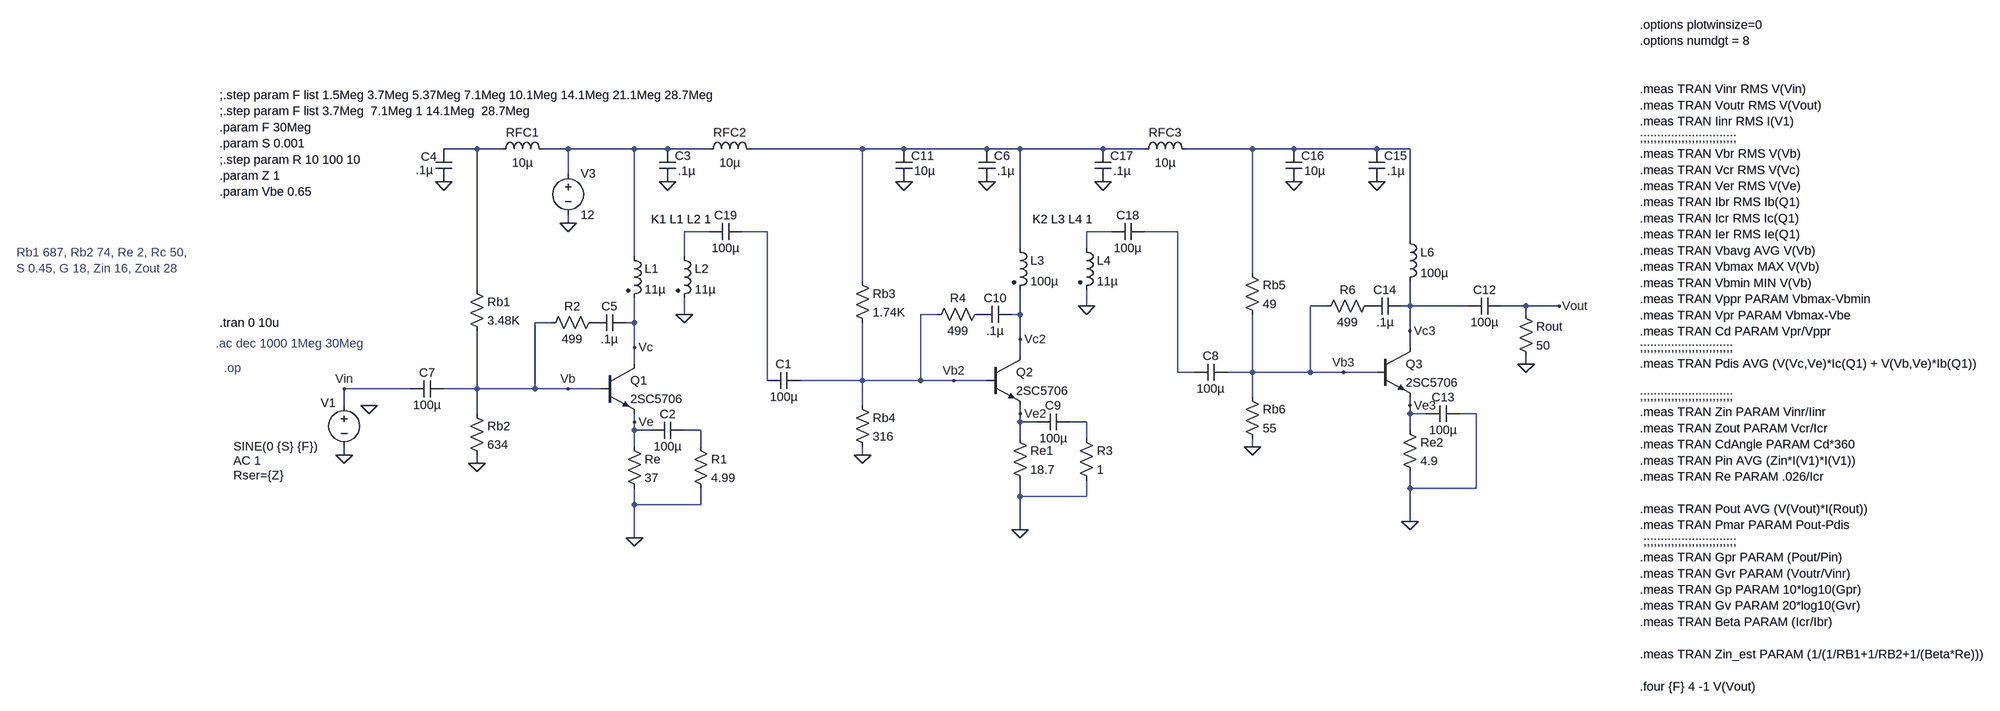
[diagram p0: schematic 2SC5706x3  testing.asc]
2SC5706x3  testing.asc, the LTspice schematic file:
Version 4
SHEET 1 3408 1496
WIRE 112 -272 48 -272
WIRE 160 -272 112 -272
WIRE 288 -272 240 -272
WIRE 416 -272 288 -272
WIRE 480 -272 416 -272
WIRE 560 -272 480 -272
WIRE 896 -272 640 -272
WIRE 976 -272 896 -272
WIRE 1136 -272 976 -272
WIRE 1200 -272 1136 -272
WIRE 1360 -272 1200 -272
WIRE 1440 -272 1360 -272
WIRE 1648 -272 1520 -272
WIRE 1728 -272 1648 -272
WIRE 1888 -272 1728 -272
WIRE 1952 -272 1888 -272
WIRE 288 -224 288 -272
WIRE 288 -128 288 -144
WIRE 560 -112 512 -112
WIRE 672 -112 624 -112
WIRE 1376 -112 1328 -112
WIRE 1504 -112 1440 -112
WIRE 1952 -96 1952 -272
WIRE 1200 -80 1200 -272
WIRE 1328 -80 1328 -112
WIRE 416 -64 416 -272
WIRE 512 -64 512 -112
WIRE 1648 -32 1648 -272
WIRE 896 -16 896 -272
WIRE 112 0 112 -272
WIRE 1328 32 1328 0
WIRE 1792 32 1760 32
WIRE 1952 32 1952 -16
WIRE 1952 32 1936 32
WIRE 2064 32 1952 32
WIRE 2176 32 2128 32
WIRE 2240 32 2176 32
WIRE 512 48 512 16
WIRE 1040 48 1008 48
WIRE 1200 48 1200 0
WIRE 1200 48 1184 48
WIRE 2176 48 2176 32
WIRE 256 64 224 64
WIRE 416 64 416 16
WIRE 416 64 400 64
WIRE 1952 80 1952 32
WIRE 1200 96 1200 48
WIRE 416 112 416 64
WIRE 1952 112 1952 80
WIRE 1200 128 1200 96
WIRE 416 144 416 112
WIRE 2176 144 2176 128
WIRE 1504 160 1504 -112
WIRE 1536 160 1504 160
WIRE 1648 160 1648 48
WIRE 1648 160 1600 160
WIRE 1760 160 1760 32
WIRE 1760 160 1648 160
WIRE 1824 160 1760 160
WIRE 1888 160 1824 160
WIRE 672 176 672 -112
WIRE 896 176 896 64
WIRE 896 176 736 176
WIRE 1008 176 1008 48
WIRE 1008 176 896 176
WIRE 1072 176 1008 176
WIRE 1136 176 1072 176
WIRE -16 192 -144 192
WIRE 112 192 112 80
WIRE 112 192 48 192
WIRE 224 192 224 64
WIRE 224 192 112 192
WIRE 288 192 224 192
WIRE 352 192 288 192
WIRE 1648 208 1648 160
WIRE -144 224 -144 192
WIRE 896 224 896 176
WIRE 1952 224 1952 208
WIRE 112 240 112 192
WIRE 1200 240 1200 224
WIRE 1952 240 1952 224
WIRE 1984 240 1952 240
WIRE 2080 240 2048 240
WIRE 416 256 416 240
WIRE 1200 256 1200 240
WIRE 1232 256 1200 256
WIRE 1328 256 1296 256
WIRE 416 272 416 256
WIRE 448 272 416 272
WIRE 544 272 512 272
WIRE 1952 272 1952 240
WIRE 1200 288 1200 256
WIRE 1328 288 1328 256
WIRE 416 304 416 272
WIRE 544 304 544 272
WIRE 1648 304 1648 288
WIRE -144 320 -144 304
WIRE 896 320 896 304
WIRE 112 336 112 320
WIRE 1952 384 1952 352
WIRE 2080 384 2080 240
WIRE 2080 384 1952 384
WIRE 1200 400 1200 368
WIRE 1328 400 1328 368
WIRE 1328 400 1200 400
WIRE 416 416 416 384
WIRE 544 416 544 384
WIRE 544 416 416 416
WIRE 1952 448 1952 384
WIRE 1200 464 1200 400
WIRE 416 480 416 416
FLAG -144 320 0
FLAG 112 336 0
FLAG 416 480 0
FLAG 2240 32 Vout
FLAG 2176 144 0
FLAG 288 192 Vb
FLAG 416 256 Ve
FLAG -144 192 Vin
FLAG 416 112 Vc
FLAG 288 -128 0
FLAG 48 -208 0
FLAG 480 -208 0
FLAG -96 224 0
FLAG 896 320 0
FLAG 1072 176 Vb2
FLAG 1200 240 Ve2
FLAG 1200 96 Vc2
FLAG 1200 464 0
FLAG 1136 -208 0
FLAG 976 -208 0
FLAG 512 48 0
FLAG 1648 304 0
FLAG 1824 160 Vb3
FLAG 1952 224 Ve3
FLAG 1952 80 Vc3
FLAG 1952 448 0
FLAG 1888 -208 0
FLAG 1728 -208 0
FLAG 1360 -208 0
FLAG 1328 32 0
SYMBOL voltage -144 208 R0
WINDOW 0 -45 11 Left 2
WINDOW 3 -214 95 Left 2
WINDOW 123 -214 123 Left 2
WINDOW 39 -214 151 Left 2
SYMATTR InstName V1
SYMATTR Value SINE(0 {S} {F})
SYMATTR Value2 AC 1
SYMATTR SpiceLine Rser={Z}
SYMBOL res 96 -16 R0
SYMATTR InstName Rb1
SYMATTR Value 3.48K
SYMBOL res 96 224 R0
SYMATTR InstName Rb2
SYMATTR Value 634
SYMBOL res 400 288 R0
SYMATTR InstName Re
SYMATTR Value 37
SYMBOL res 2160 32 R0
SYMATTR InstName Rout
SYMATTR Value 50
SYMBOL cap 48 176 R90
WINDOW 0 0 32 VBottom 2
WINDOW 3 32 32 VTop 2
SYMATTR InstName C7
SYMATTR Value 100µ
SYMBOL npn 352 144 R0
SYMATTR InstName Q1
SYMATTR Value 2SC5706
SYMBOL voltage 288 -240 R0
WINDOW 123 0 0 Left 0
WINDOW 39 0 0 Left 0
SYMATTR InstName V3
SYMATTR Value 12
SYMBOL cap 736 160 R90
WINDOW 0 0 32 VBottom 2
WINDOW 3 32 32 VTop 2
SYMATTR InstName C1
SYMATTR Value 100µ
SYMBOL cap 512 256 R90
WINDOW 0 0 32 VBottom 2
WINDOW 3 32 32 VTop 2
SYMATTR InstName C2
SYMATTR Value 100µ
SYMBOL ind 144 -256 R270
WINDOW 0 32 56 VTop 2
WINDOW 3 5 56 VBottom 2
SYMATTR InstName RFC1
SYMATTR Value 10µ
SYMBOL cap 32 -272 R0
WINDOW 0 -28 15 Left 2
WINDOW 3 -38 41 Left 2
SYMATTR InstName C4
SYMATTR Value .1µ
SYMBOL cap 464 -272 R0
WINDOW 0 30 14 Left 2
WINDOW 3 36 43 Left 2
SYMATTR InstName C3
SYMATTR Value .1µ
SYMBOL ind2 400 -80 R0
SYMATTR InstName L1
SYMATTR Value 11µ
SYMATTR Type ind
SYMBOL res 528 288 R0
SYMATTR InstName R1
SYMATTR Value 4.99
SYMBOL cap 400 48 R90
WINDOW 0 0 32 VBottom 2
WINDOW 3 32 32 VTop 2
SYMATTR InstName C5
SYMATTR Value .1µ
SYMBOL res 352 48 R90
WINDOW 0 0 56 VBottom 2
WINDOW 3 32 56 VTop 2
SYMATTR InstName R2
SYMATTR Value 499
SYMBOL res 880 -32 R0
SYMATTR InstName Rb3
SYMATTR Value 1.74K
SYMBOL res 880 208 R0
SYMATTR InstName Rb4
SYMATTR Value 316
SYMBOL res 1184 272 R0
SYMATTR InstName Re1
SYMATTR Value 18.7
SYMBOL npn 1136 128 R0
SYMATTR InstName Q2
SYMATTR Value 2SC5706
SYMBOL cap 1600 144 R90
WINDOW 0 0 32 VBottom 2
WINDOW 3 32 32 VTop 2
SYMATTR InstName C8
SYMATTR Value 100µ
SYMBOL cap 1296 240 R90
WINDOW 0 0 32 VBottom 2
WINDOW 3 32 32 VTop 2
SYMATTR InstName C9
SYMATTR Value 100µ
SYMBOL ind2 1184 -96 R0
SYMATTR InstName L3
SYMATTR Value 100µ
SYMATTR Type ind
SYMBOL res 1312 272 R0
SYMATTR InstName R3
SYMATTR Value 1
SYMBOL cap 1184 32 R90
WINDOW 0 0 32 VBottom 2
WINDOW 3 32 32 VTop 2
SYMATTR InstName C10
SYMATTR Value .1µ
SYMBOL res 1136 32 R90
WINDOW 0 0 56 VBottom 2
WINDOW 3 32 56 VTop 2
SYMATTR InstName R4
SYMATTR Value 499
SYMBOL cap 1120 -272 R0
WINDOW 0 30 14 Left 2
WINDOW 3 36 43 Left 2
SYMATTR InstName C6
SYMATTR Value .1µ
SYMBOL ind 544 -256 R270
WINDOW 0 32 56 VTop 2
WINDOW 3 5 56 VBottom 2
SYMATTR InstName RFC2
SYMATTR Value 10µ
SYMBOL cap 960 -272 R0
WINDOW 0 30 14 Left 2
WINDOW 3 36 43 Left 2
SYMATTR InstName C11
SYMATTR Value 10µ
SYMBOL ind2 496 -80 R0
SYMATTR InstName L2
SYMATTR Value 11µ
SYMATTR Type ind
SYMBOL res 1632 -48 R0
SYMATTR InstName Rb5
SYMATTR Value 49
SYMBOL res 1632 192 R0
SYMATTR InstName Rb6
SYMATTR Value 55
SYMBOL res 1936 256 R0
SYMATTR InstName Re2
SYMATTR Value 4.9
SYMBOL npn 1888 112 R0
SYMATTR InstName Q3
SYMATTR Value 2SC5706
SYMBOL cap 2128 16 R90
WINDOW 0 0 32 VBottom 2
WINDOW 3 32 32 VTop 2
SYMATTR InstName C12
SYMATTR Value 100µ
SYMBOL cap 2048 224 R90
WINDOW 0 0 32 VBottom 2
WINDOW 3 32 32 VTop 2
SYMATTR InstName C13
SYMATTR Value 100µ
SYMBOL ind 1936 -112 R0
SYMATTR InstName L6
SYMATTR Value 100µ
SYMBOL cap 1936 16 R90
WINDOW 0 0 32 VBottom 2
WINDOW 3 32 32 VTop 2
SYMATTR InstName C14
SYMATTR Value .1µ
SYMBOL res 1888 16 R90
WINDOW 0 0 56 VBottom 2
WINDOW 3 32 56 VTop 2
SYMATTR InstName R6
SYMATTR Value 499
SYMBOL cap 1872 -272 R0
WINDOW 0 30 14 Left 2
WINDOW 3 36 43 Left 2
SYMATTR InstName C15
SYMATTR Value .1µ
SYMBOL cap 1712 -272 R0
WINDOW 0 30 14 Left 2
WINDOW 3 36 43 Left 2
SYMATTR InstName C16
SYMATTR Value 10µ
SYMBOL cap 1344 -272 R0
WINDOW 0 30 14 Left 2
WINDOW 3 36 43 Left 2
SYMATTR InstName C17
SYMATTR Value .1µ
SYMBOL ind 1424 -256 R270
WINDOW 0 32 56 VTop 2
WINDOW 3 5 56 VBottom 2
SYMATTR InstName RFC3
SYMATTR Value 10µ
SYMBOL ind2 1312 -96 R0
SYMATTR InstName L4
SYMATTR Value 11µ
SYMATTR Type ind
SYMBOL cap 1440 -128 R90
WINDOW 0 0 32 VBottom 2
WINDOW 3 32 32 VTop 2
SYMATTR InstName C18
SYMATTR Value 100µ
SYMBOL cap 624 -128 R90
WINDOW 0 0 32 VBottom 2
WINDOW 3 32 32 VTop 2
SYMATTR InstName C19
SYMATTR Value 100µ
TEXT -384 64 Left 2 !.tran 0 10u
TEXT 2672 -512 Left 2 !.options plotwinsize=0\n.options numdgt = 8\n \n \n.meas TRAN Vinr RMS V(Vin)\n.meas TRAN Voutr RMS V(Vout)\n.meas TRAN Iinr RMS I(V1)\n;;;;;;;;;;;;;;;;;;;;;;;;;;;;\n.meas TRAN Vbr RMS V(Vb)\n.meas TRAN Vcr RMS V(Vc)\n.meas TRAN Ver RMS V(Ve)\n.meas TRAN Ibr RMS Ib(Q1)\n.meas TRAN Icr RMS Ic(Q1)\n.meas TRAN Ier RMS Ie(Q1)\n.meas TRAN Vbavg AVG V(Vb)\n.meas TRAN Vbmax MAX V(Vb)\n.meas TRAN Vbmin MIN V(Vb)\n.meas TRAN Vppr PARAM Vbmax-Vbmin\n.meas TRAN Vpr PARAM Vbmax-Vbe\n.meas TRAN Cd PARAM Vpr/Vppr\n;;;;;;;;;;;;;;;;;;;;;;;;;;;\n.meas TRAN Pdis AVG (V(Vc,Ve)*Ic(Q1) + V(Vb,Ve)*Ib(Q1))\n \n;;;;;;;;;;;;;;;;;;;;;;;;;;;\n.meas TRAN Zin PARAM Vinr/Iinr\n.meas TRAN Zout PARAM Vcr/Icr\n.meas TRAN CdAngle PARAM Cd*360\n.meas TRAN Pin AVG (Zin*I(V1)*I(V1))\n.meas TRAN Re PARAM .026/Icr\n \n.meas TRAN Pout AVG (V(Vout)*I(Rout))\n.meas TRAN Pmar PARAM Pout-Pdis\n ;;;;;;;;;;;;;;;;;;;;;;;;;;;\n.meas TRAN Gpr PARAM (Pout/Pin)\n.meas TRAN Gvr PARAM (Voutr/Vinr)\n.meas TRAN Gp PARAM 10*log10(Gpr)\n.meas TRAN Gv PARAM 20*log10(Gvr)\n.meas TRAN Beta PARAM (Icr/Ibr)\n \n.meas TRAN Zin_est PARAM (1/(1/RB1+1/RB2+1/(Beta*Re)))\n \n.four {F} 4 -1 V(Vout)
TEXT -384 -376 Left 2 !;.step param F list 1.5Meg 3.7Meg 5.37Meg 7.1Meg 10.1Meg 14.1Meg 21.1Meg 28.7Meg\n;.step param F list 3.7Meg  7.1Meg 1 14.1Meg  28.7Meg\n.param F 30Meg\n.param S 0.001\n;.step param R 10 100 10\n.param Z 1\n.param Vbe 0.65
TEXT -392 104 Left 2 ;.ac dec 1000 1Meg 30Meg
TEXT -776 -72 Left 2 ;Rb1 687, Rb2 74, Re 2, Rc 50, \nS 0.45, G 18, Zin 16, Zout 28
TEXT -376 152 Left 2 ;.op
TEXT 448 -136 Left 2 !K1 L1 L2 1
TEXT 1224 -136 Left 2 !K2 L3 L4 1

The netlist it stands for:
* 2SC5706x3  testing.asc
V1 Vin 0 SINE(0 {S} {F}) AC 1 Rser={Z}
Rb1 N001 Vb 3.48K
Rb2 Vb 0 634
Re Ve 0 37
Rout Vout 0 50
C7 Vb Vin 100µ
Q1 Vc Vb Ve 0 2SC5706
V3 N002 0 12
C1 Vb2 N006 100µ
C2 N010 Ve 100µ
L§RFC1 N001 N002 10µ
C4 N001 0 .1µ
C3 N002 0 .1µ
L1 N002 Vc 11µ
R1 N010 0 4.99
C5 Vc P001 .1µ
R2 P001 Vb 499
Rb3 N003 Vb2 1.74K
Rb4 Vb2 0 316
Re1 Ve2 0 18.7
Q2 Vc2 Vb2 Ve2 0 2SC5706
C8 Vb3 N008 100µ
C9 N009 Ve2 100µ
L3 N003 Vc2 100µ
R3 N009 0 1
C10 Vc2 P002 .1µ
R4 P002 Vb2 499
C6 N003 0 .1µ
L§RFC2 N002 N003 10µ
C11 N003 0 10µ
L2 N005 0 11µ
Rb5 N004 Vb3 49
Rb6 Vb3 0 55
Re2 Ve3 0 4.9
Q3 Vc3 Vb3 Ve3 0 2SC5706
C12 Vout Vc3 100µ
C13 0 Ve3 100µ
L6 N004 Vc3 100µ
C14 Vc3 P003 .1µ
R6 P003 Vb3 499
C15 N004 0 .1µ
C16 N004 0 10µ
C17 N003 0 .1µ
L§RFC3 N003 N004 10µ
L4 N007 0 11µ
C18 N008 N007 100µ
C19 N006 N005 100µ
.model NPN NPN
.model PNP PNP
.lib standard.bjt
.tran 0 10u
.options plotwinsize=0
.options numdgt = 8
.meas TRAN Vinr RMS V(Vin)
.meas TRAN Voutr RMS V(Vout)
.meas TRAN Iinr RMS I(V1)
;;;;;;;;;;;;;;;;;;;;;;;;;;;;
.meas TRAN Vbr RMS V(Vb)
.meas TRAN Vcr RMS V(Vc)
.meas TRAN Ver RMS V(Ve)
.meas TRAN Ibr RMS Ib(Q1)
.meas TRAN Icr RMS Ic(Q1)
.meas TRAN Ier RMS Ie(Q1)
.meas TRAN Vbavg AVG V(Vb)
.meas TRAN Vbmax MAX V(Vb)
.meas TRAN Vbmin MIN V(Vb)
.meas TRAN Vppr PARAM Vbmax-Vbmin
.meas TRAN Vpr PARAM Vbmax-Vbe
.meas TRAN Cd PARAM Vpr/Vppr
;;;;;;;;;;;;;;;;;;;;;;;;;;;
.meas TRAN Pdis AVG (V(Vc,Ve)*Ic(Q1) + V(Vb,Ve)*Ib(Q1))
;;;;;;;;;;;;;;;;;;;;;;;;;;;
.meas TRAN Zin PARAM Vinr/Iinr
.meas TRAN Zout PARAM Vcr/Icr
.meas TRAN CdAngle PARAM Cd*360
.meas TRAN Pin AVG (Zin*I(V1)*I(V1))
.meas TRAN Re PARAM .026/Icr
.meas TRAN Pout AVG (V(Vout)*I(Rout))
.meas TRAN Pmar PARAM Pout-Pdis
 ;;;;;;;;;;;;;;;;;;;;;;;;;;;
.meas TRAN Gpr PARAM (Pout/Pin)
.meas TRAN Gvr PARAM (Voutr/Vinr)
.meas TRAN Gp PARAM 10*log10(Gpr)
.meas TRAN Gv PARAM 20*log10(Gvr)
.meas TRAN Beta PARAM (Icr/Ibr)
.meas TRAN Zin_est PARAM (1/(1/RB1+1/RB2+1/(Beta*Re)))
.four {F} 4 -1 V(Vout)
;.step param F list 1.5Meg 3.7Meg 5.37Meg 7.1Meg 10.1Meg 14.1Meg 21.1Meg 28.7Meg
;.step param F list 3.7Meg  7.1Meg 1 14.1Meg  28.7Meg
.param F 30Meg
.param S 0.001
;.step param R 10 100 10
.param Z 1
.param Vbe 0.65
* .ac dec 1000 1Meg 30Meg
* Rb1 687, Rb2 74, Re 2, Rc 50,
* S 0.45, G 18, Zin 16, Zout 28
* .op
K1 L1 L2 1
K2 L3 L4 1
.backanno
.end